# EAGLE design efishery (EAGLE 8.4.0)
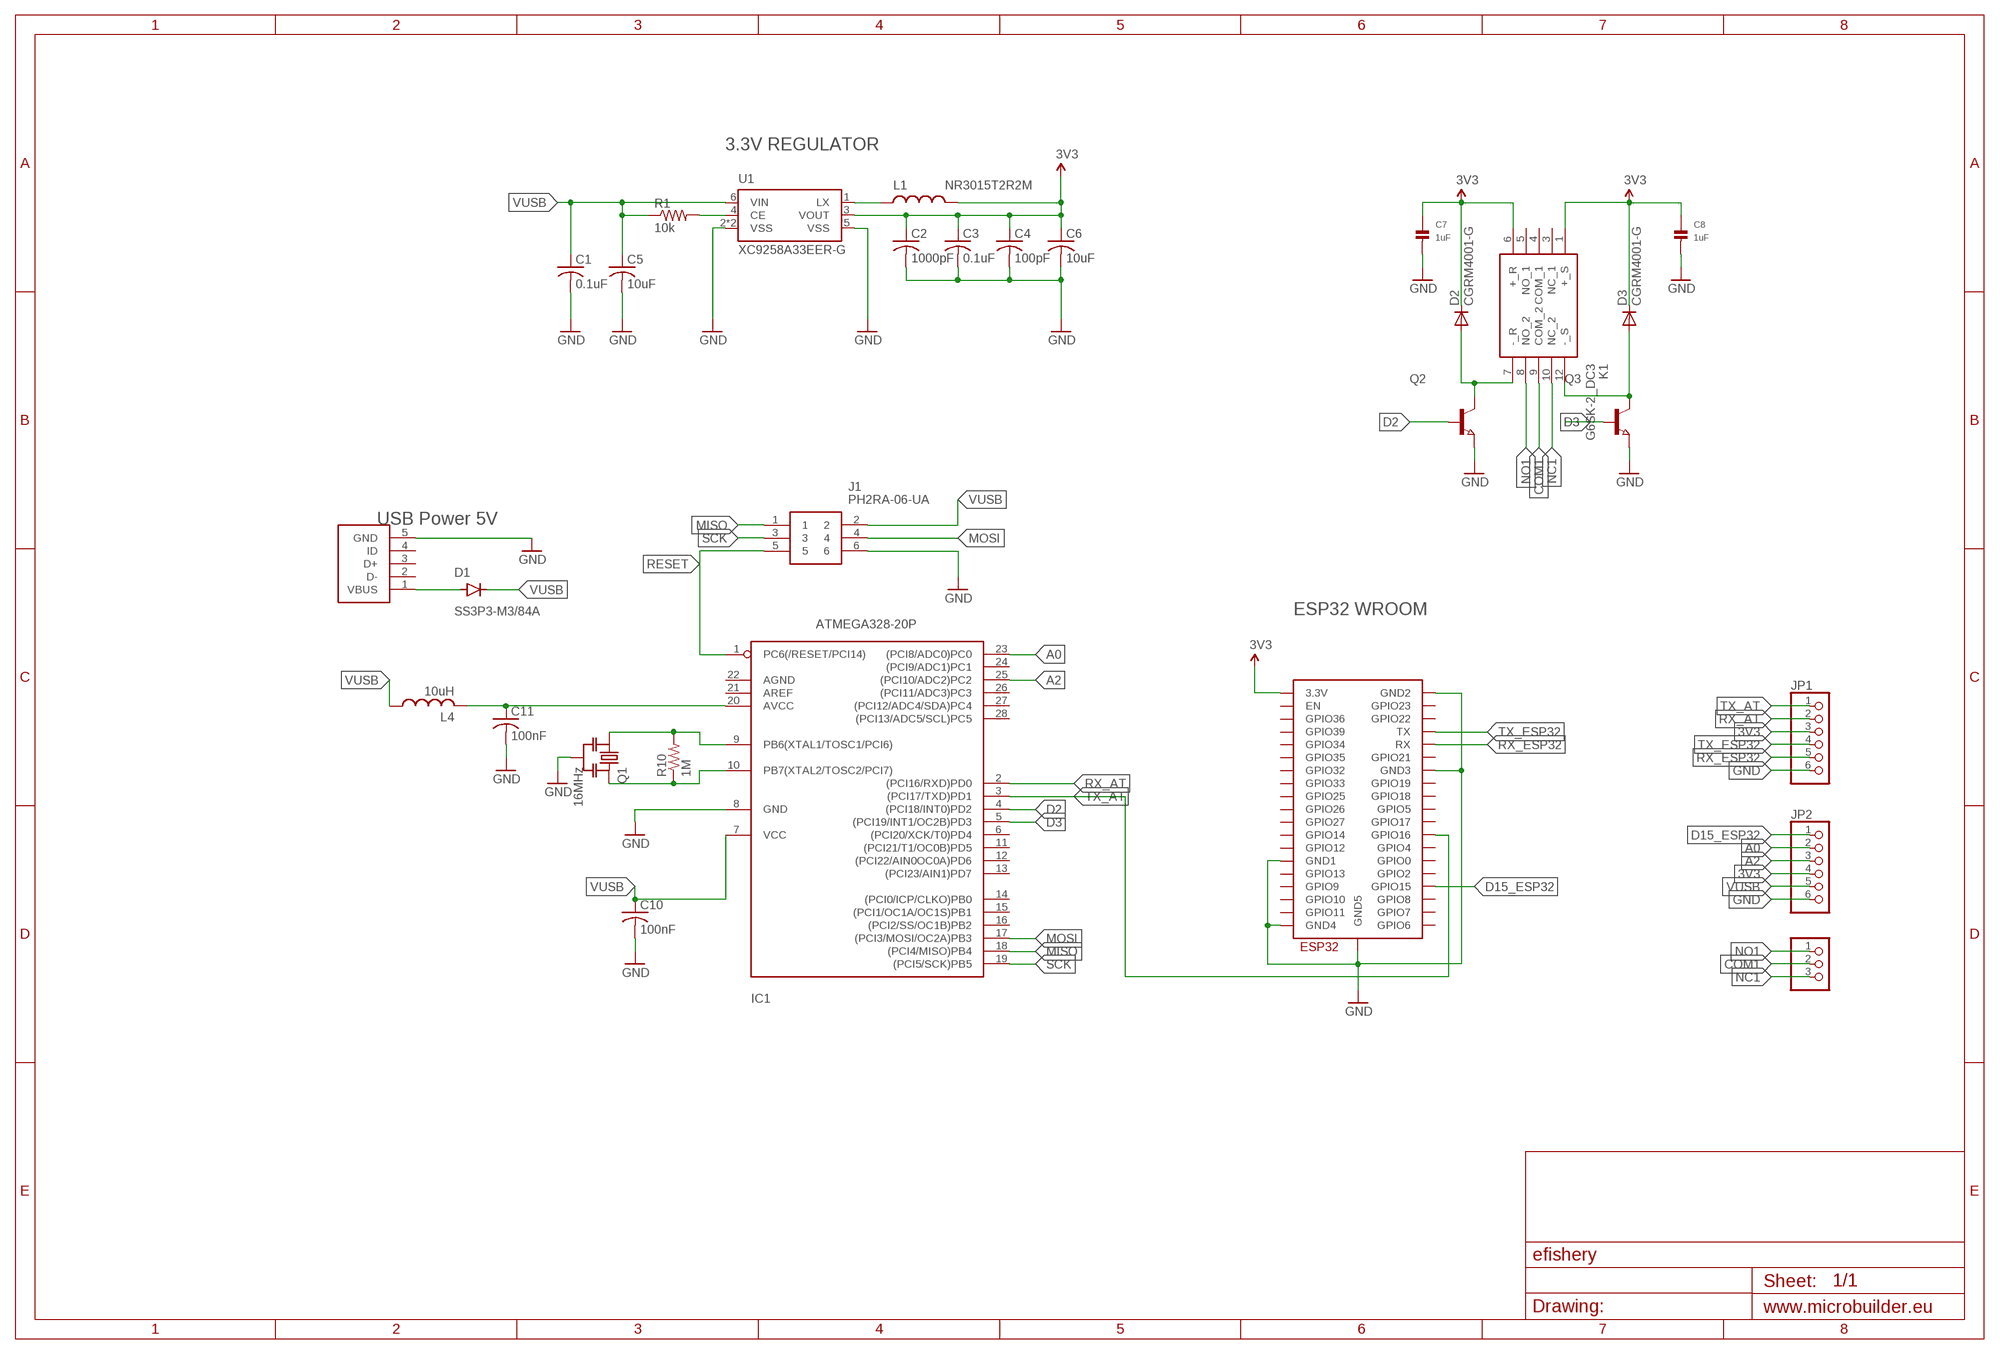
[diagram p0: schematic, sheet 1]

## Parts
C1  0.1uF  C-USC0402  [C0402]
C2  1000pF  C-USC0402  [C0402]
C3  0.1uF  C-USC0402  [C0402]
C4  100pF  C-USC0402  [C0402]
C5  10uF  C-USC0603  [C0603]
C6  10uF  C-USC0603  [C0603]
C7  1uF  CAP_CERAMIC_0805  [_0805]
C8  1uF  CAP_CERAMIC_0805  [_0805]
C10  100nF  C_USB  [0603]
C11  100nF  C_USB  [0603]
D1  SS3P3-M3/84A  DIODE  [DIODE-DO-220AA(SMP)]
D2  CGRM4001-G  [SOD-123_MINI-SMA]
D3  CGRM4001-G  [SOD-123_MINI-SMA]
IC1  ATMEGA328-20P  [DIL28-3]
J1  PH2RA-06-UA  [HDRRA6W64P254_2X3_762X250X500P]
JP1  PINHD-1X6  [1X06]
JP2  PINHD-1X6  [1X06]
JP3  PINHD-1X3  [1X03]
K1  G6SK-2_DC3  [G6SK2DC3]
L1  NR3015T2R2M  INDUCTOR-SPARKFUNNR3015T4R7M  [INDUCTOR-NR3015]
L4  10uH  L-USL2012C  [L2012C]
Q1  16MHz  RESONATOR-MURATACSTCR_G  [RESONATOR_MURATA3]
Q2  NPN-TRANSISTOR_SOT23  [SOT23]
Q3  NPN-TRANSISTOR_SOT23  [SOT23]
R1  10k  R-US_R0402  [R0402]
R10  1M  R_USA  [0603]
U1  XC9258A33EER-G  [USP-6C]
U$3  USB-MICRO-B-SOCKET-AMPHENOL  [USB-B-SMT-AMPHENOL]
U$4  ESP32-WROOM  [ESP32-WROOM]

## Nets
3V3: C2.1 C3.1 C4.1 C6.1 C7.1 C8.1 D2.C D3.C JP1.3 JP2.4 K1.1(+_S) K1.6(+_R) L1.2 U1.3(VOUT) U$4.3V3(3.3V)
A0: IC1.23((PCI8/ADC0)PC0) JP2.2
A2: IC1.25((PCI10/ADC2)PC2) JP2.3
COM1: JP3.2 K1.9(COM_2)
D2: IC1.4((PCI18/INT0)PD2) Q2.1(B)
D3: IC1.5((PCI19/INT1/OC2B)PD3) Q3.1(B)
D15_ESP32: JP2.1 U$4.IO15(GPIO15)
GND: C1.2 C2.2 C3.2 C4.2 C5.2 C6.2 C7.2 C8.2 C10.2 C11.2 IC1.8(GND) J1.6 JP1.6 JP2.6 Q1.2 Q2.2(E) Q3.2(E) U1.2(VSS) U1.5(VSS) U1.P$1(VSS) U$3.5(GND) U$4.GND1 U$4.GND2 U$4.GND3 U$4.GND4 U$4.GND5
MISO: IC1.18((PCI4/MISO)PB4) J1.1
MOSI: IC1.17((PCI3/MOSI/OC2A)PB3) J1.4
N$1: D1.ANODE U$3.1(VBUS)
N$2: R1.2 U1.4(CE)
N$3: D2.A K1.7(-_R) Q2.3(C)
N$4: D3.A K1.12(-_S) Q3.3(C)
N$5: L1.1 U1.1(LX)
N$11: IC1.9(PB6(XTAL1/TOSC1/PCI6)) Q1.1 R10.2
N$12: IC1.10(PB7(XTAL2/TOSC2/PCI7)) Q1.3 R10.1
N$13: C11.1 IC1.20(AVCC) L4.2
NC1: JP3.3 K1.10(NC_2)
NO1: JP3.1 K1.8(NO_2)
RESET: IC1.1(PC6(/RESET/PCI14)) J1.5
RX_AT: IC1.2((PCI16/RXD)PD0) JP1.2
RX_ESP32: JP1.5 U$4.RX
SCK: IC1.19((PCI5/SCK)PB5) J1.3
TX_AT: IC1.3((PCI17/TXD)PD1) JP1.1 U$4.IO16(GPIO16)
TX_ESP32: JP1.4 U$4.TX
VUSB: C1.1 C5.1 C10.1 D1.CATHODE IC1.7(VCC) J1.2 JP2.5 L4.1 R1.1 U1.6(VIN)
Unconnected: IC1.6((PCI20/XCK/T0)PD4) IC1.11((PCI21/T1/OC0B)PD5) IC1.12((PCI22/AIN0OC0A)PD6) IC1.13((PCI23/AIN1)PD7) IC1.14((PCI0/ICP/CLKO)PB0) IC1.15((PCI1/OC1A/OC1S)PB1) IC1.16((PCI2/SS/OC1B)PB2) IC1.21(AREF) IC1.22(AGND) IC1.24((PCI9/ADC1)PC1) IC1.26((PCI11/ADC3)PC3) IC1.27((PCI12/ADC4/SDA)PC4) IC1.28((PCI13/ADC5/SCL)PC5) K1.3(NC_1) K1.4(COM_1) K1.5(NO_1) U$3.2(D-) U$3.3(D+) U$3.4(ID) U$4.CLK(GPIO6) U$4.CMD(GPIO11) U$4.EN U$4.IO0(GPIO0) U$4.IO2(GPIO2) U$4.IO4(GPIO4) U$4.IO5(GPIO5) U$4.IO12(GPIO12) U$4.IO13(GPIO13) U$4.IO14(GPIO14) U$4.IO17(GPIO17) U$4.IO18(GPIO18) U$4.IO19(GPIO19) U$4.IO21(GPIO21) U$4.IO22(GPIO22) U$4.IO23(GPIO23) U$4.IO25(GPIO25) U$4.IO26(GPIO26) U$4.IO27(GPIO27) U$4.IO32(GPIO32) U$4.IO33(GPIO33) U$4.IO34(GPIO34) U$4.IO35(GPIO35) U$4.SD0(GPIO7) U$4.SD1(GPIO8) U$4.SD2(GPIO9) U$4.SD3(GPIO10) U$4.SENSOR_VN(GPIO39) U$4.SENSOR_VP(GPIO36)

## Notes on the sheet
- 3.3V REGULATOR
- USB Power 5V
- ESP32 WROOM

## Library data of the parts
C1-C4 = adafruit:C-US: CAPACITOR, American symbol
C5 C6 = rcl:C-US: CAPACITOR, American symbol; SPICEPREFIX: C
C7 C8 = microbuilder:CAP_CERAMIC: Ceramic Capacitors 0402 - 0402 Surface Mount Capacitors 16pF 50V 5% [Digikey: 445-4899-2-ND] 18pF 50V 5% [Digikey: 490-1281-2-ND] 22pF 50V 5% [Digikey: 490-1283-2-ND] 68pF 50V 5% [Digikey: 490-1289-2-ND] 0.1uF 10V 10% [Digikey: 490-1318-2-ND] 1.0uF 6.3V 10% [Digikey: 490-1320-2-ND] 0603 - 0603 Surface Mount Capacitors 16 pF 50V 5% [Digikey: 445-5051-2-ND] 22 pF 50V [Digikey: PCC220ACVTR-ND] 33 pF 50V 5% [Digikey: 490-1415-1-ND] 56pF 50V 5% [Digikey: 490-1421-1-ND] 220pF 50V 5% [Digikey: 445-1285-1-ND] 680 pF 50V 2200 pF 50V 5% C0G [Digikey: 445-1297-1-ND] 5600 pF 100V 5% X7R [Digikey: 478-3711-1-ND] 0.1 µF 25V 10% [Digikey: PCC2277TR-ND] 0.22 µF 16V 10% X7R [Digikey: 445-1318-1-ND] 1.0 µF 25V 10% [Digikey: 445-5146-2-ND] 0603 - RF Specific 3pF 250V +/-0.1pF RF [Digikey: 712-1347-1-ND] 18 pF 250V 5% [Digikey: 478-3505-1-ND or 712-1322-1-ND] 56 pF 250V 5% C0G RF [Digikey: 490-4867-1-ND] 68 pF 250V RF [Digikey: 490-4868-1-ND] 0805 - 0805 Surface Mount Capacitors 220 pF 250V 2% RF Ceramic Capacitor [Digikey: 712-1398-1-ND] 1000 pF 50V 2% NP0 Ceramic Capacitor [Digikey: 478-3760-1-ND] 0.1 µF 25V 10% Ceramic Capacitor [Digikey: PCC1828TR-ND] 1.0 µF 16V 10% Ceramic Capacitor[Digikey: 490-1691-2-ND] 10.0 µF 10V 10% Ceramic Capacitor[Digikey: 709-1228-1-ND] 10.0 uF 16V 10% Ceramic Capacitor [Digikey: 478-5165-2-ND] 47 uF 6.3V 20% Ceramic Capacitor [Digikey: 587-1779-1-ND or 399-5506-1-ND] 1206 - 1206 Surface Mount Capacitors 47uF 10V 20% Ceramic Capacitor [Digikey: 490-5528-1-ND or 399-5508-1-ND or 445-6010-1-ND] 100uF 6.3V -20%, +80% Y5V Ceramic Capacitor (Digikey: 490-4512-1-ND, Mouser: 81-GRM31CF50J107ZE1L)
C10 C11 = m-pad-2.1:C_US: Capacitors in various packages
D1 = Particle:DIODE
D2 D3 = diode:CGRM400*-G: Molded plasitc,JEDEC SOD-123/Mini SMA Source: Comchip CGRM4001-G.pdf
IC1 = atmega328:ATMEGA328*P: MICROCONTROLLER 32 kBytes FLASH 2 kBytes SRAM 1 kBytes EEPROM USART 8-channel 10 bit ADC
J1 = PH2RA-06-UA:PH2RA-06-UA: CONN HEADER R/A 6POS 2.54MM Source: Datasheet <https://static6.arrow.com/aropdfconversion/38d430c3bbd26836f869f57df34a7f03090e7de1/782downloader.phppph2ra-xx-ua.pdf>; ARROW_PART_NUMBER: PH2RA-06-UA; ARROW_PRICE-STOCK: https://www.arrow.com/en/products/ph2ra-06-ua/adam-tech; DESCRIPTION: CONN HEADER R/A 6POS 2.54MM; HEIGHT: 5mm; MANUFACTURER_NAME: Adam Tech; MANUFACTURER_PART_NUMBER: PH2RA-06-UA
JP1 JP2 = adafruit:PINHD-1X6: PIN HEADER
JP3 = adafruit:PINHD-1X3: PIN HEADER
K1 = G6SK-2_DC3:G6SK-2_DC3: Low Signal Relays - PCB Source: Datasheet <https://mouser.componentsearchengine.com/Datasheets/1/G6SK-2 DC3.pdf>; DESCRIPTION: Low Signal Relays - PCB; HEIGHT: 9.4mm; MANUFACTURER_NAME: Omron Electronics; MANUFACTURER_PART_NUMBER: G6SK-2 DC3; MOUSER_PART_NUMBER: 653-G6SK-2DC3; MOUSER_PRICE-STOCK: https://www.mouser.co.uk/ProductDetail/Omron-Electronics/G6SK-2-DC3?qs=wkx8pu8tL7IRrKyN%2F0WfTQ%3D%3D
L1 = Particle:INDUCTOR-SPARKFUN: Inductors Basic Inductor/Choke - 0603 and 1206. Footprints are not proven and vary greatly between part numbers. SRN6045- 33uH, 20% 1.4A; NR3015T4R7M: 4.7uH
L4 = resistor:L-US: INDUCTOR, American symbol
Q1 = m-pad-2.1:RESONATOR-MURATA: Murata ceramic Resonator "ceralock" CSTCE series with built in load capacitance +- 0.5% tolerance 12.51MHz to 19.99MHz 16MHz murata part#: CSTCE16M0V53-R0 16MHz digikey part#: 490-1198-1-ND $1.33 each
Q2 Q3 = semicon-smd-ipc:NPN-TRANSISTOR_: NPN TRANSISTOR
R1 = adafruit:R-US_: RESISTOR, American symbol
R10 = m-pad-2.1:R_US: Resistors in various packages
U1 = Particle:XC9258: 1.0A Synchronous Step-Down DC/DC Converters
U$3 = rickk2:USB-MICRO-B-SOCKET-AMPHENOL: CONN USB MICRO B RECPT SMT R/A $0.42 Amphenol FCI 10118194-0001LF https://www.digikey.com/products/en?keywords=609-4618-1-nd
U$4 = ESP32:ESP32-WROOM

## Board
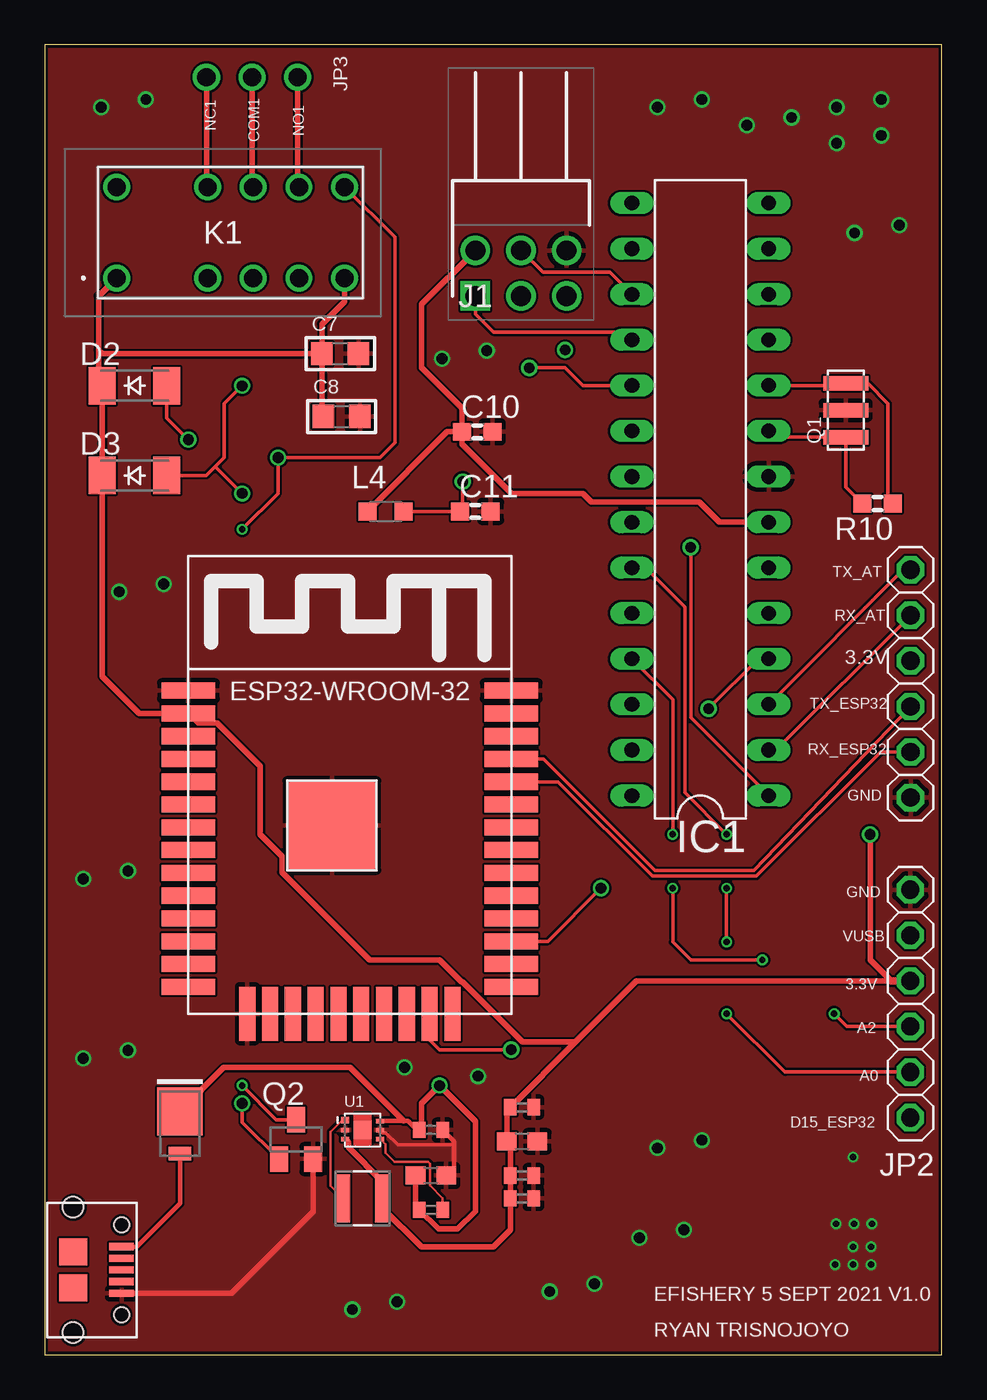
[diagram p1: board, top side]
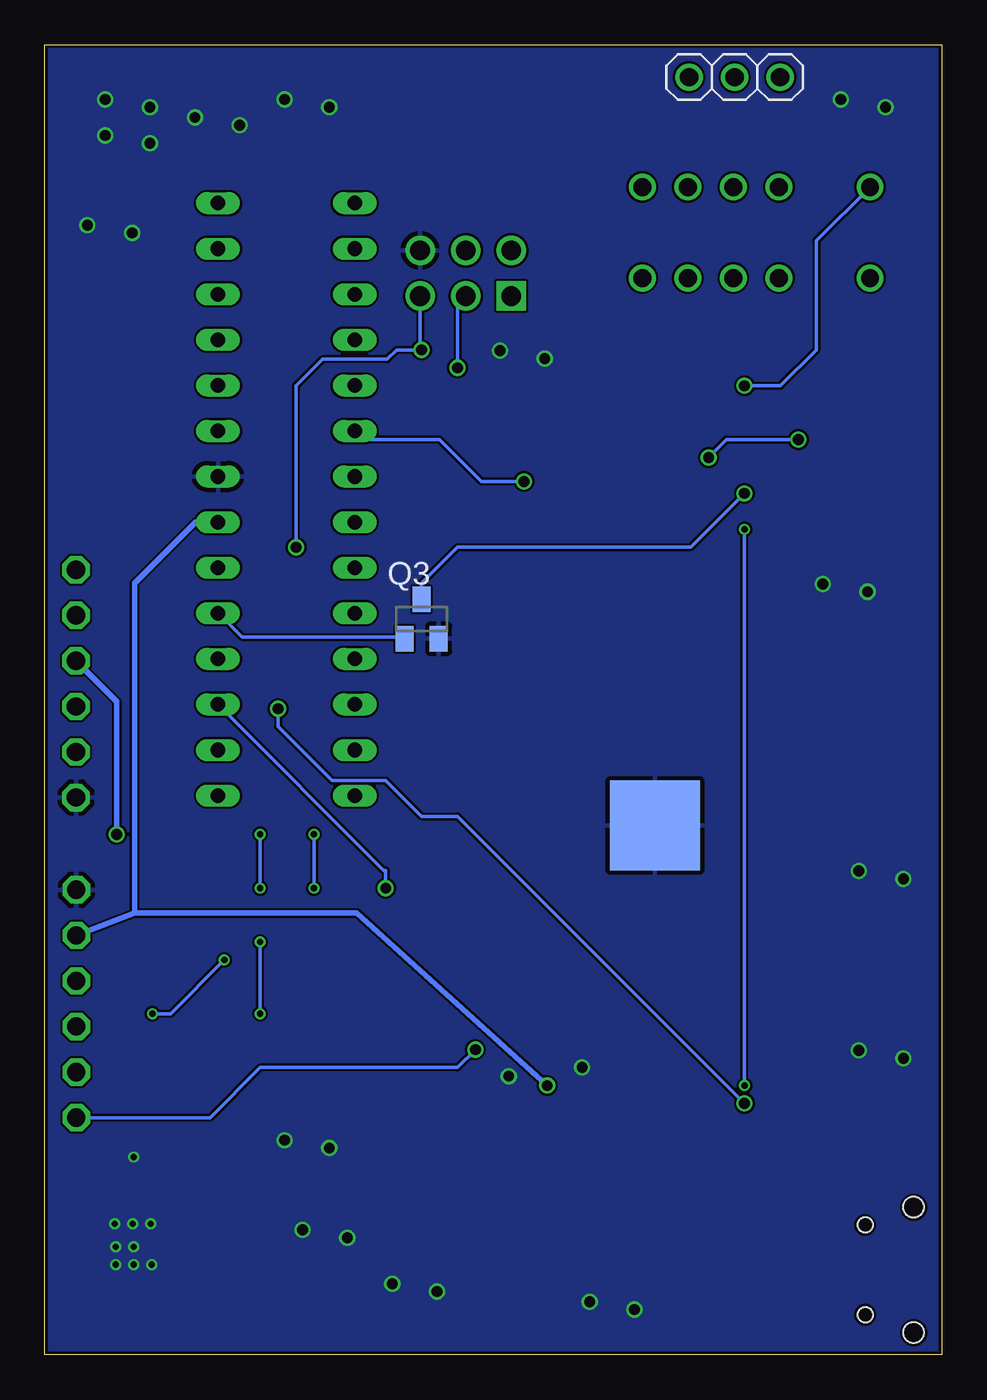
[diagram p2: board, bottom side, seen from below]

Size 50 x 73 mm. Coordinates in mm from the lower left corner, seen from the top.
Outline: 0,0 50,0 50,73 0,73 0,0
Copper layers (1*16): Top 0.035mm / dielectric 1.5mm / Bottom 0.035mm
Design rules "SparkFun-2-Layer-Minimum-JLCPCB": minimum track width 5mil, minimum drill 0.3mm, track to track 5mil, track to pad 5mil, pad to pad 5mil, via to via 5mil, smd to smd 5mil, copper to edge 7mil, drill to drill 7mil, minimum pad ring 5mil, minimum via ring 5mil, stop-mask expansion 2.5mil, vias tented up to drill 25mil, thermal gap 10mil

### Footprints (pad centres in the part's own frame; a part is rotated, then mirrored left to right if it is on the bottom)
C0402 = smd 0.7 x 0.9: 1 -0.65,0; 2 0.65,0
C0603 = smd 1.1 x 1: 1 -0.85,0; 2 0.85,0
_0805 = smd 1.2 x 1.3: 1 -1.016,0; 2 1.016,0
0603 = smd 1 x 1: 1 -0.85,0; 2 0.85,0
DIODE-DO-220AA(SMP) = smd 0.762 x 1.27: ANODE 2.349,0 | smd 2.667 x 2.54: CATHODE 0,0
SOD-123_MINI-SMA = smd 1.5 x 2.1: A 1.8,0; C -1.8,0
DIL28-3 = drill 0.813 long: 1 -16.51,-3.81; 2 -13.97,-3.81; 3 -11.43,-3.81; 4 -8.89,-3.81; 5 -6.35,-3.81; 6 -3.81,-3.81; 7 -1.27,-3.81; 8 1.27,-3.81; 9 3.81,-3.81; 10 6.35,-3.81; 11 8.89,-3.81; 12 11.43,-3.81; 13 13.97,-3.81; 14 16.51,-3.81; 15 16.51,3.81; 16 13.97,3.81; 17 11.43,3.81; 18 8.89,3.81; 19 6.35,3.81; 20 3.81,3.81; 21 1.27,3.81; 22 -1.27,3.81; 23 -3.81,3.81; 24 -6.35,3.81; 25 -8.89,3.81; 26 -11.43,3.81; 27 -13.97,3.81; 28 -16.51,3.81
HDRRA6W64P254_2X3_762X250X500P = drill 1.1 pad 1.65 square: 1 0,0 | drill 1.1 pad 1.65: 2 0,2.54; 3 2.54,0; 4 2.54,2.54; 5 5.08,0; 6 5.08,2.54
1X06 = drill 1.016 octagon: 1 -6.35,0; 2 -3.81,0; 3 -1.27,0; 4 1.27,0; 5 3.81,0; 6 6.35,0
1X03 = drill 1.016: 1 -2.54,0; 2 0,0; 3 2.54,0
G6SK2DC3 = drill 1 pad 1.5: 1 0,0; 3 5.08,0; 4 7.62,0; 5 10.16,0; 6 12.7,0; 7 12.7,5.08; 8 10.16,5.08; 9 7.62,5.08; 10 5.08,5.08; 12 0,5.08
INDUCTOR-NR3015 = smd 0.8 x 2.7: 1 -1.1,0; 2 1.1,0
L2012C = smd 1 x 1: 1 -1,0; 2 1,0
RESONATOR_MURATA3 = smd 0.8 x 2.5: 1 -1.5,0; 2 0,0; 3 1.5,0
SOT23 = smd 1 x 1.4: 1 -0.95,-1.1; 2 0.95,-1.1; 3 0,1.1
R0402 = smd 0.7 x 0.9: 1 -0.65,0; 2 0.65,0
USP-6C = smd 0.45 x 0.35: 1 -0.975,0.55 | smd 0.45 x 0.25: 2 -0.975,0; 3 -0.975,-0.5; 4 0.975,-0.5; 5 0.975,0; 6 0.975,0.5 | smd 1.016 x 1.016: P$1 0,0
USB-B-SMT-AMPHENOL = smd 0.4 x 1.35: 1 -1.3,0; 2 -0.65,0; 3 0,0; 4 0.65,0; 5 1.3,0 | smd 1.5 x 1.55: P$6 -1,-2.7; P$7 1,-2.7 | hole 0.85: -2.5,0; 2.5,0 | hole 1.15: -3.5,-2.7; 3.5,-2.7
ESP32-WROOM = smd 3 x 0.9: 3V3 0,16.74; EN 0,15.47; GND1 0,18.01; GND3 18,18.01; IO0 18,1.5; IO4 18,2.77; IO5 18,6.58; IO12 0,1.5; IO14 0,2.77; IO16 18,4.04; IO17 18,5.31; IO18 18,7.85; IO19 18,9.12; IO21 18,11.66; IO22 18,15.47; IO23 18,16.74; IO25 0,6.58; IO26 0,5.31; IO27 0,4.04; IO32 0,9.12; IO33 0,7.85; IO34 0,11.66; IO35 0,10.39; NC 18,10.39; RX 18,12.93; SENSOR_VN 0,12.93; SENSOR_VP 0,14.2; TX 18,14.2 | smd 0.9 x 3: CLK 9.635,0; CMD 8.365,0; GND2 3.285,0; IO2 14.715,0; IO13 4.555,0; IO15 13.445,0; SD0 10.905,0; SD1 12.175,0; SD2 5.825,0; SD3 7.095,0 | smd 5 x 5: GND4 8,10.5 | smd 5 x 5 bottom: GND5 8,10.5

### Placement (x,y rotation side)
C1  21.52,12.52 0 top
C2  26.6,8.71 0 top
C3  26.6,9.98 0 top
C4  26.6,13.79 0 top
C5  21.52,9.98 0 top
C6  26.6,11.89 0 top
C7  16.46,55.79 0 top
C8  16.54,52.29 0 top
C10  24.1,51.43 0 top
C11  24,47 0 top
D1  7.53,13.56 270 top
D2  5,54 0 top
D3  5,49 0 top
IC1  36.54,47.67 90 top
J1  24,59 0 top
JP1  48.26,37.4 270 top
JP2  48.25,19.56 90 top
JP3  11.55,71.2 0 bottom
K1  4,60 0 top
L1  17.71,8.71 0 top
L4  19,47 0 top
Q1  44.64,52.64 90 top
Q2  14,12 0 top
Q3  29,41 0 bottom
R1  21.52,8.08 0 top
R10  46.42,47.43 180 top
U1  17.71,12.52 0 top
U$3  4.27,4.72 270 top
U$4  8,19 0 top

### Tracks (layer width: path | path; a pad name or v marks a point on that pad's centre or on a via)
3V3  (via drill 0.6)
  Top 0.305: K1.1 3,59 3,56 | 3,56 3,54.2 D2.C D3.C 3.2,37.8 5.26,35.74 U$4.3V3 8.54,35.2 9.62,35.2 12,32.81 12,29 13.22,27.78 13.22,26.88 18.11,22 22,22 23.22,20.78 23.28,20.78 26.64,17.42 29.58,17.42 | C7.1 15.45,52.37 C8.1 | 3,56 3.21,55.79 C7.1 | K1.6 16.7,58.7 15.45,57.45 C7.1 | U1.3 16.93,11.83 16.93,11.55 18.81,9.67 L1.2 18.81,8.19 21,6 25,6 25.95,6.95 C2.1 C3.1 25.95,11.69 C6.1 25.75,13.59 C4.1 29.58,17.42 | 29.58,17.42 32.98,20.83 JP2.4 | v46,29 46,22 47.17,20.83
  Top 0.406: 47.17,20.83 JP2.4
  Bottom 0.305: JP1.3 46,36.41 v46,29
A0  (via drill 0.35)
  Top 0.203: JP2.2 41.25,15.75 v38,19 | v38,23 v38,26 | v38,29 35.67,31.33 35.67,41.67 33.48,43.86 IC1.23
  Bottom 0.203: v38,19 v38,23 | v38,26 v38,29
A2  (via drill 0.35)
  Top 0.203: IC1.25 35,36.51 v35,29 | v35,26 35,23 36,22 v40,22 | v44,19 44.71,18.29 JP2.3
  Bottom 0.203: v35,29 v35,26 | v40,22 43,19 v44,19
COM1
  Top 0.305: JP3.2 11.55,65.15 K1.9
D2  (via drill 0.6)
  Top 0.2: IC1.4 39.78,38.78 v37,36 | v11,14 11,12.95 Q2.1
  Bottom 0.2: v37,36 37,35 34,32 31,32 29,30 27,30 v11,14
D3
  Bottom 0.2: IC1.5 40.32,41.32 39,40 30.05,40 Q3.1
D15_ESP32  (via drill 0.6)
  Top 0.203: U$4.IO15 21.45,17.55 22,17 v26,17
  Bottom 0.203: v26,17 27,16 38,16 40.79,13.21 JP2.1
GND  (via drill 0.35, 0.6)
  Top 0.2: U1.5 18.83,12.38 19,12.38 19.69,11.68 22.79,11.68 22.81,11.66
  Top 0.254: C1.2 22.81,11.88 22.81,11.66 22.81,10.43 C5.2
  Top 0.305: U$3.5 10.42,3.42 14.95,7.95 Q2.2
  other vias: 24.14,15.52 36.63,11.95 46.05,5.01 44.05,5.01 46.1,7.29 45.1,7.29 46.05,6.01 45.05,5.01 44.1,7.29 45.05,6.01 20.05,16.01 45.05,11.01 34.14,11.52 4.63,26.95 2.14,26.52 4.63,16.95 2.14,16.52 19.63,2.95 17.14,2.52 30.63,3.95 28.14,3.52 35.63,6.95 33.14,6.52 24.63,55.95 22.14,55.52 5.63,69.95 3.14,69.52 36.63,69.95 34.14,69.52 41.63,68.95 39.14,68.52 46.63,69.95 44.14,69.52 46.63,67.95 44.14,67.52 47.63,62.95 45.14,62.52 6.63,42.95 4.14,42.52
  pour Top: 0,0 0,73 50,73 50,0
  pour Bottom: 0,0 0,73 50,73 50,0
MISO
  Top 0.203: J1.1 24,58 25,57 32.29,57 IC1.18
MOSI
  Top 0.203: IC1.17 31.5,60.33 27.75,60.33 J1.4
N$1
  Top 0.254: U$3.1 5.13,6.02 7.53,8.42 D1.ANODE
N$2
  Top 0.152: U1.4 18.98,11.73 18.98,11.25 19.49,10.74 21.37,10.74 21.47,10.64 21.47,9.42 22.17,8.72 R1.2
N$3  (via drill 0.35, 0.6)
  Top 0.2: K1.7 19.51,62.27 19.51,50.83 18.68,50 v13,50 | v8,51 6.8,52.2 D2.A
  Top 0.203: Q2.3 12.9,13.1 v11,15 | v11,46 13,48 v13,50
  Bottom 0.2: v13,50 12,51 v8,51
  Bottom 0.203: v11,15 v11,46
N$4  (via drill 0.6)
  Top 0.2: v11,54 10,53 10,50 9.5,49.5 | 9.5,49.5 9,49 D3.A | 9.5,49.5 v11,48
  Bottom 0.2: K1.12 7,62.08 7,56 9,54 v11,54 | Q3.3 29,43 27,45 14,45 v11,48
N$5
  Top 0.152: L1.1 15.92,9.41 15.92,12.41 16.58,13.07 U1.1
N$11
  Top 0.2: R10.2 44.64,48.36 Q1.1 40.69,51.14 IC1.9
N$12
  Top 0.2: IC1.10 44.53,54.02 Q1.3 45.87,54.14 47,53 47,47.7 R10.1
N$13  (via drill 0.6)
  Top 0.2: L4.2 23,47 C11.1
  Top 0.203: v23.29,48.67 23.29,47.29 23,47
  Bottom 0.203: v23.29,48.67 25.67,48.67 28,51 32.25,51 IC1.20
NC1
  Top 0.305: JP3.3 9.01,65.15 K1.10
NO1
  Top 0.305: JP3.1 14.09,65.15 K1.8
RESET  (via drill 0.6)
  Top 0.203: IC1.1 36,35.51 v36,45
  Bottom 0.203: J1.5 29.08,56.08 v29,56 30.39,56 30.91,55.47 34.53,55.47 36,54 v36,45
RX_AT
  Top 0.2: IC1.2 40.75,33.7 JP1.2
RX_ESP32
  Top 0.2: U$4.RX 28.61,31.93 33.87,26.67 39.67,26.67 46.59,33.59 JP1.5
SCK  (via drill 0.6)
  Top 0.203: IC1.19 32.71,54 30,54 29,55 v27,55
  Bottom 0.203: J1.3 27,58.54 v27,55
TX_AT  (via drill 0.6)
  Top 0.2: JP1.1 47.85,43.75 IC1.3 | U$4.IO16 28.04,23.04 v31,26
  Bottom 0.2: IC1.3 31.11,27 31,27 v31,26
TX_ESP32
  Top 0.2: U$4.TX 27.8,33.2 34,27 39.52,27 JP1.4
VUSB  (via drill 0.6)
  Top 0.127: 20.76,8.08 R1.1 | 20.76,9.98 C5.1 | C1.1 20.76,12.52
  Top 0.254: U1.6 20,13.02 20.26,13.02 20.76,12.52
  Top 0.305: L4.1 22.43,51.43 C10.1 | J1.2 21,58.54 21,55 23.25,52.75 C10.1 | IC1.7 37.6,46.4 36.48,47.52 30.48,47.52 30,48 26,48 23.25,50.75 C10.1 | D1.CATHODE 9.97,16 17.02,16 20,13.02 | C1.1 21,12.65 21,14 v22,15 24,13 24,8 23,7 21.95,7 | C5.1 20.67,8.28 R1.1 21.95,7 | 21.95,7 22,7
  Bottom 0.305: JP2.5 45,24.61 | IC1.7 41.6,46.4 45,43 45,24.61 | 45,24.61 32.61,24.61 v22,15

### Text on the board
tNames: NC1 | COM1 | NO1 | TX_AT | RX_AT | 3.3V | TX_ESP32 | RX_ESP32 | GND | GND | VUSB | 3.3V | A2 | A0 | D15_ESP32 | EFISHERY 5 SEPT 2021 V1.0 | RYAN TRISNOJOYO